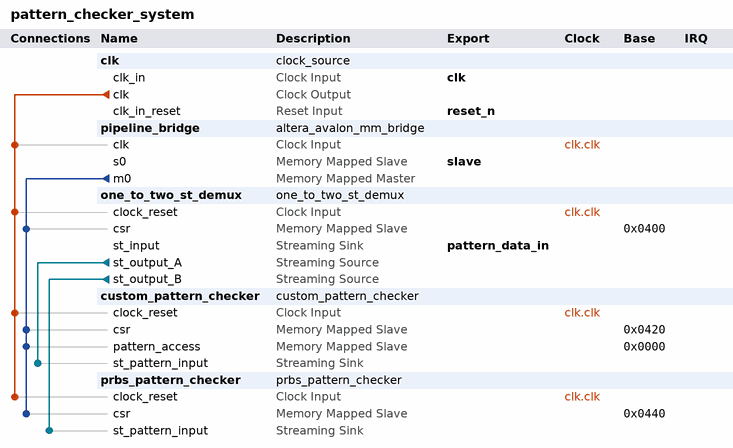
[diagram p0: system contents]
# Platform Designer (Qsys) system pattern_checker_system
# Parameters at their usual value, and those the tool derives, are not listed.
package require -exact qsys 10.1
create_system pattern_checker_system
set_project_property DEVICE_FAMILY CYCLONEIII

add_instance clk clock_source 10.1
set_instance_parameter_value clk clockFrequency 50000000
set_instance_parameter_value clk clockFrequencyKnown false

add_instance pipeline_bridge altera_avalon_mm_bridge 10.1
set_instance_parameter_value pipeline_bridge DATA_WIDTH 32
set_instance_parameter_value pipeline_bridge ADDRESS_WIDTH 11
set_instance_parameter_value pipeline_bridge ADDRESS_UNITS SYMBOLS
set_instance_parameter_value pipeline_bridge BURSTCOUNT_UNITS SYMBOLS
set_instance_parameter_value pipeline_bridge MAX_PENDING_RESPONSES 1

add_instance one_to_two_st_demux one_to_two_st_demux 1.0
set_instance_parameter_value one_to_two_st_demux DATA_WIDTH 32

add_instance custom_pattern_checker custom_pattern_checker 1.0
set_instance_parameter_value custom_pattern_checker DATA_WIDTH 32
set_instance_parameter_value custom_pattern_checker MAX_PATTERN_LENGTH 256

add_instance prbs_pattern_checker prbs_pattern_checker 1.0
set_instance_parameter_value prbs_pattern_checker DATA_WIDTH 32

# connections
add_connection clk.clk custom_pattern_checker.clock_reset clock
add_connection clk.clk one_to_two_st_demux.clock_reset clock
add_connection clk.clk pipeline_bridge.clk clock
add_connection clk.clk prbs_pattern_checker.clock_reset clock
add_connection pipeline_bridge.m0 custom_pattern_checker.csr avalon
set_connection_parameter_value pipeline_bridge.m0/custom_pattern_checker.csr baseAddress 0x0420
add_connection pipeline_bridge.m0 custom_pattern_checker.pattern_access avalon
set_connection_parameter_value pipeline_bridge.m0/custom_pattern_checker.pattern_access baseAddress 0x0000
add_connection pipeline_bridge.m0 one_to_two_st_demux.csr avalon
set_connection_parameter_value pipeline_bridge.m0/one_to_two_st_demux.csr baseAddress 0x0400
add_connection pipeline_bridge.m0 prbs_pattern_checker.csr avalon
set_connection_parameter_value pipeline_bridge.m0/prbs_pattern_checker.csr baseAddress 0x0440
add_connection one_to_two_st_demux.st_output_A custom_pattern_checker.st_pattern_input avalon_streaming
add_connection one_to_two_st_demux.st_output_B prbs_pattern_checker.st_pattern_input avalon_streaming

# exported interfaces
add_interface clk clock sink
set_interface_property clk EXPORT_OF clk.clk_in
add_interface reset_n reset sink
set_interface_property reset_n EXPORT_OF clk.clk_in_reset
add_interface slave avalon slave
set_interface_property slave EXPORT_OF pipeline_bridge.s0
add_interface pattern_data_in avalon_streaming sink
set_interface_property pattern_data_in EXPORT_OF one_to_two_st_demux.st_input

save_system pattern_checker_system.qsys
